# Altium project SD_Card.PrjPcb
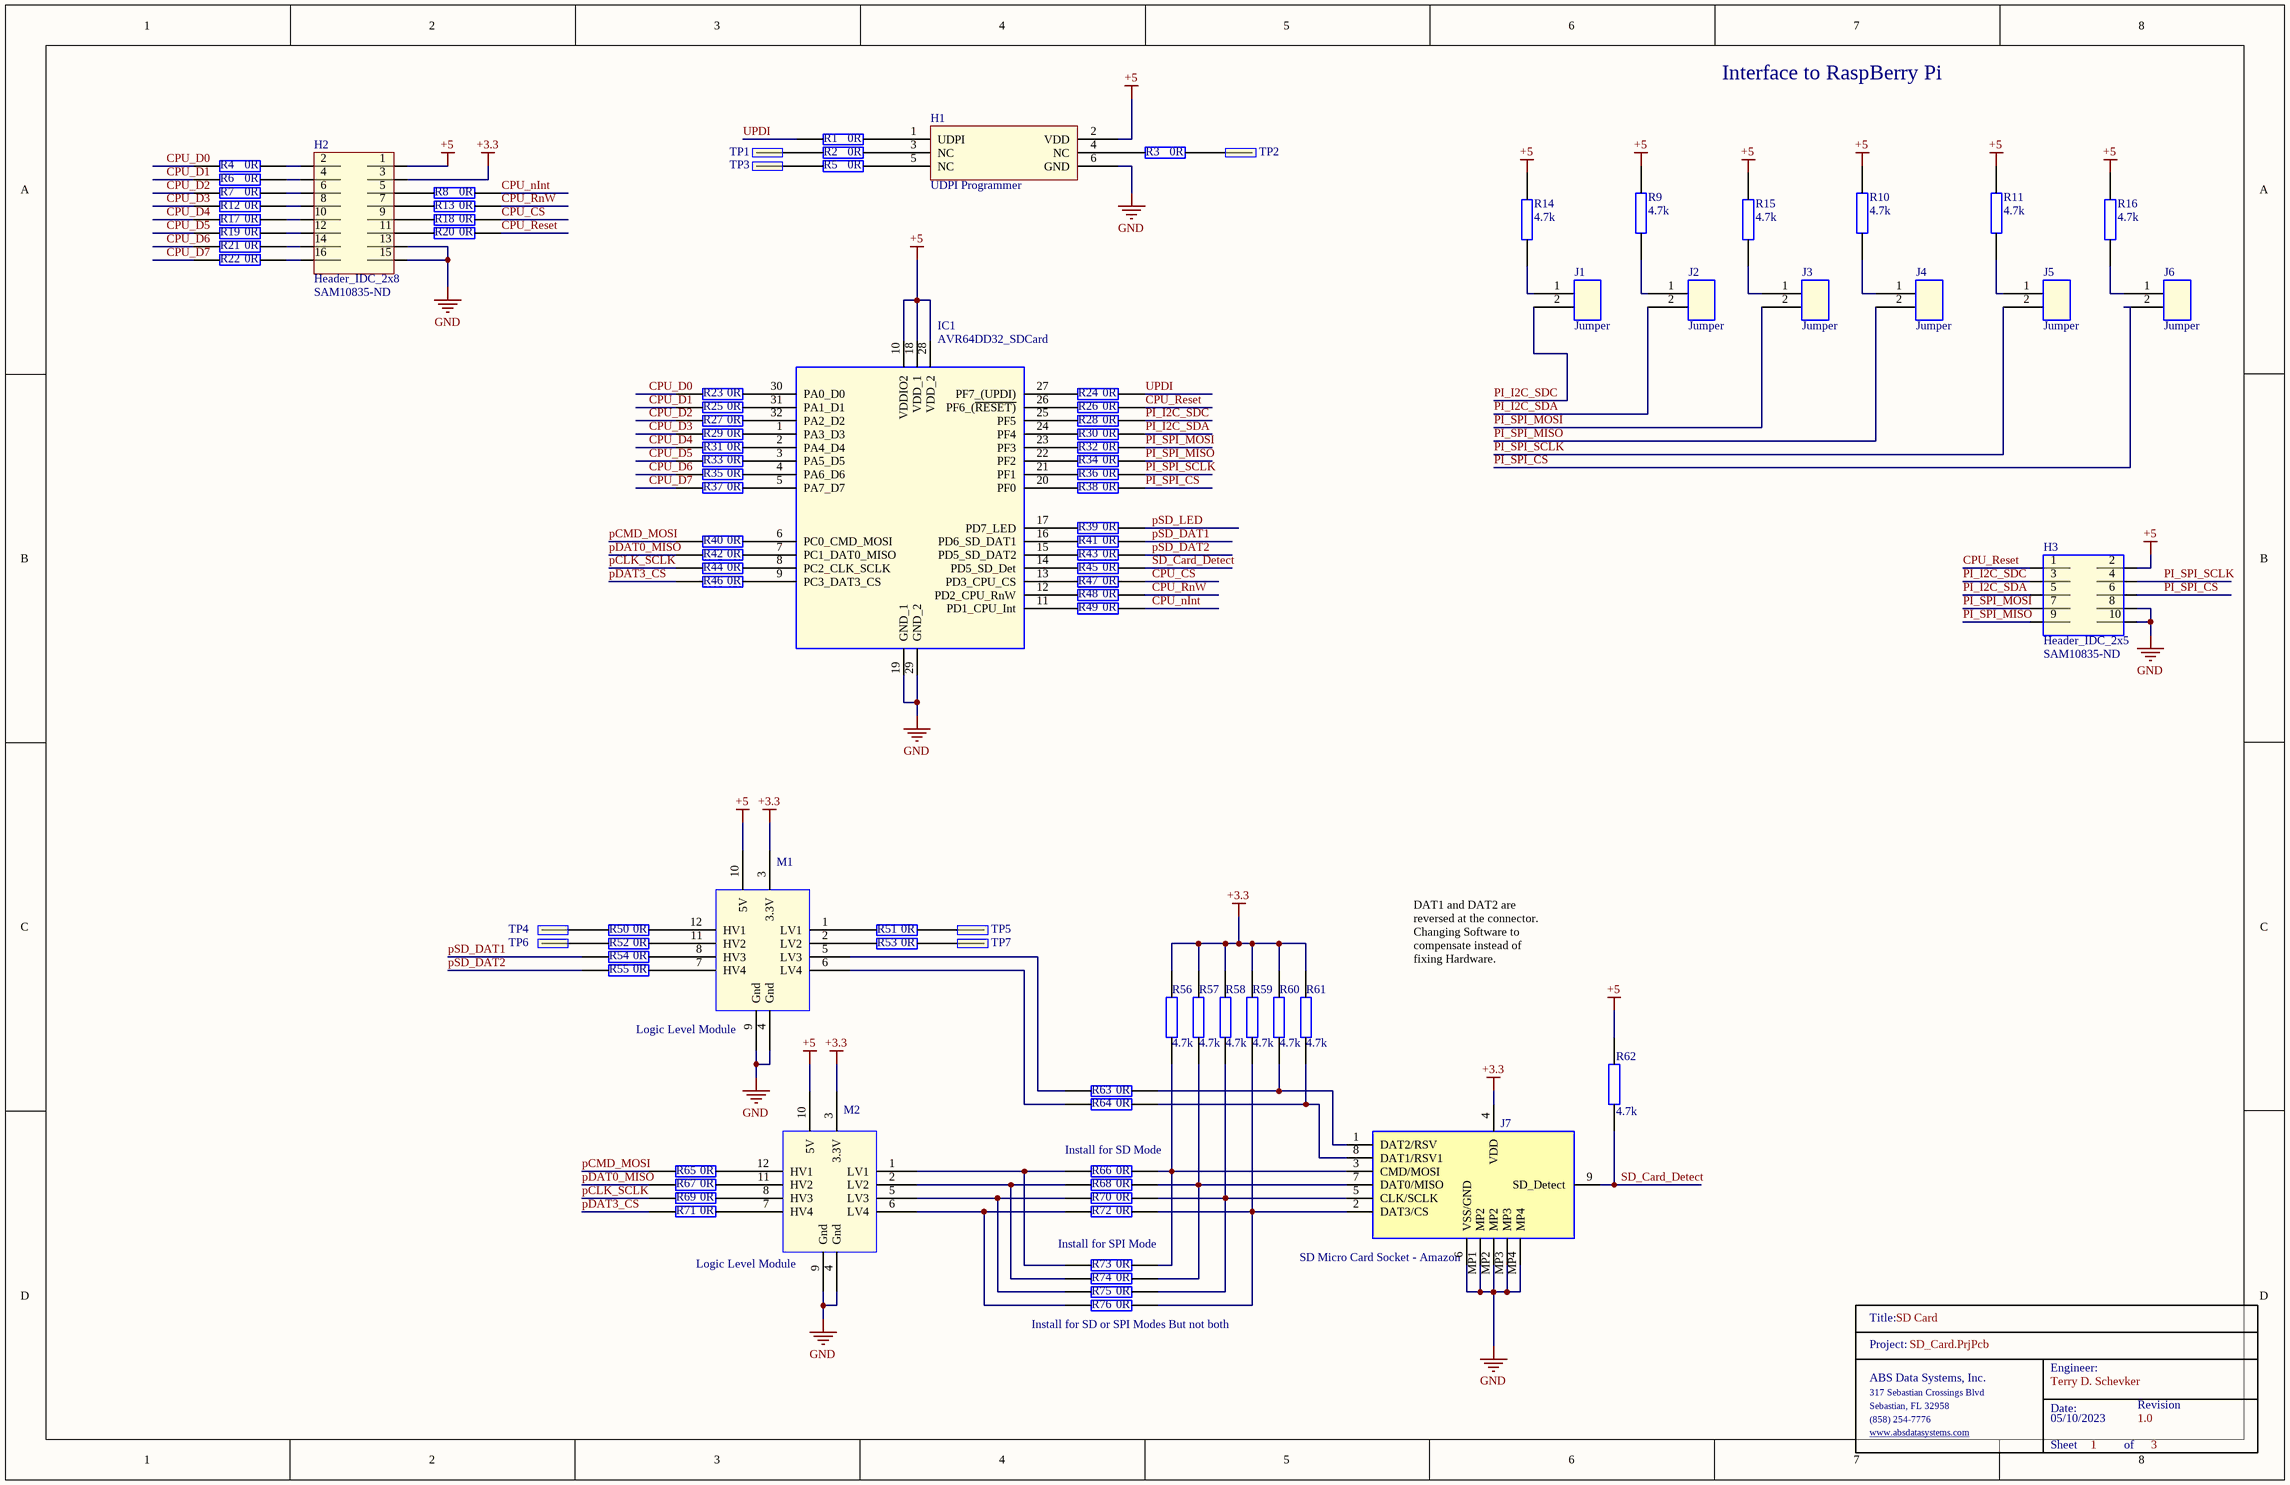
[diagram p0: SD_Card.SchDoc]
3 sheets, 201 parts. Net scope: global (net labels, ports and power ports of the same name join across sheets).
Board file: SD_Card_PCB.PcbDoc
Sheets:
  SD_Card.SchDoc
  PowerSupply.SchDoc
  SD_Card_Led_Monitor.SchDoc

## Sheet SD_Card.SchDoc: SD Card
size Tabloid; Date: 05/10/2023; Engineer: Terry D. Schevker; Revision: 1.0; SheetNumber: 1; SheetTotal: 3

### Parts
H1  UDPI Programmer  [HDR2X3]
H2  Header_IDC_2x8  Supplier Part Number 1: SAM10835-ND  [HEADER16]
H3  Header_IDC_2x5  Supplier Part Number 1: SAM10835-ND  [HDR2X5]
IC1  AVR64DD32_SDCard  [QFP80P900X900X120-32N]
J1  Jumper  [Jumper]
J2  Jumper  [Jumper]
J3  Jumper  [Jumper]
J4  Jumper  [Jumper]
J5  Jumper  [Jumper]
J6  Jumper  [Jumper]
J7  SD Micro Card Socket - Amazon  [SDMicroConnector]
M1  Logic Level Module  [Logic_Level_Module]
M2  Logic Level Module  [Logic_Level_Module]
R1  0R  [0603]
R2  0R  [0603]
R3  0R  [0603]
R4  0R  [0603]
R5  0R  [0603]
R6  0R  [0603]
R7  0R  [0603]
R8  0R  [0603]
R9  4.7k  [0603]
R10  4.7k  [0603]
R11  4.7k  [0603]
R12  0R  [0603]
R13  0R  [0603]
R14  4.7k  [0603]
R15  4.7k  [0603]
R16  4.7k  [0603]
R17  0R  [0603]
R18  0R  [0603]
R19  0R  [0603]
R20  0R  [0603]
R21  0R  [0603]
R22  0R  [0603]
R23  0R  [0603]
R24  0R  [0603]
R25  0R  [0603]
R26  0R  [0603]
R27  0R  [0603]
R28  0R  [0603]
R29  0R  [0603]
R30  0R  [0603]
R31  0R  [0603]
R32  0R  [0603]
R33  0R  [0603]
R34  0R  [0603]
R35  0R  [0603]
R36  0R  [0603]
R37  0R  [0603]
R38  0R  [0603]
R39  0R  [0603]
R40  0R  [0603]
R41  0R  [0603]
R42  0R  [0603]
R43  0R  [0603]
R44  0R  [0603]
R45  0R  [0603]
R46  0R  [0603]
R47  0R  [0603]
R48  0R  [0603]
R49  0R  [0603]
R50  0R  [0603]
R51  0R  [0603]
R52  0R  [0603]
R53  0R  [0603]
R54  0R  [0603]
R55  0R  [0603]
R56  4.7k  [0603]
R57  4.7k  [0603]
R58  4.7k  [0603]
R59  4.7k  [0603]
R60  4.7k  [0603]
R61  4.7k  [0603]
R62  4.7k  [0603]
R63  0R  [0603]
R64  0R  [0603]
R65  0R  [0603]
R66  0R  [0603]
R67  0R  [0603]
R68  0R  [0603]
R69  0R  [0603]
R70  0R  [0603]
R71  0R  [0603]
R72  0R  [0603]
R73  0R  [0603]
R74  0R  [0603]
R75  0R  [0603]
R76  0R  [0603]
TitleBlock_1  TitleBlock  (value not drawn)  (graphical)
TP1  TP  [TP]  (value not drawn)
TP2  TP  [TP]  (value not drawn)
TP3  TP  [TP]  (value not drawn)
TP4  TP  [TP]  (value not drawn)
TP5  TP  [TP]  (value not drawn)
TP6  TP  [TP]  (value not drawn)
TP7  TP  [TP]  (value not drawn)

### Nets
+3.3: H2.3 J7.4(VDD) M1.3(3.3V) M2.3(3.3V) R56.2 R57.2 R58.2 R59.2 R60.2 R61.2
+5: H1.2(VDD) H2.1 H3.2 IC1.10(VDDIO2) IC1.18(VDD_1) IC1.28(VDD_2) M1.10(5V) M2.10(5V) R9.2 R10.2 R11.2 R14.2 R15.2 R16.1 R62.2
GND: H1.6(GND) H2.13 H2.15 H3.8 H3.10 IC1.19(GND_1) IC1.29(GND_2) J7.6(VSS/GND) J7.MP1(MP2) J7.MP2 J7.MP3 J7.MP4 M1.4(Gnd) M1.9(Gnd) M2.4(Gnd) M2.9(Gnd)
CPU_CS: R18.2 R47.2
CPU_D0: R4.1 R23.1
CPU_D1: R6.1 R25.1
CPU_D2: R7.1 R27.1
CPU_D3: R12.1 R29.1
CPU_D4: R17.1 R31.1
CPU_D5: R19.1 R33.1
CPU_D6: R21.1 R35.1
CPU_D7: R22.1 R37.1
CPU_nInt: R8.2 R49.2
CPU_Reset: H3.1 R20.2 R26.2
CPU_RnW: R13.2 R48.2
pCLK_SCLK: R44.1 R69.1
pCMD_MOSI: R40.1 R65.1
pDAT0_MISO: R42.1 R67.1
pDAT3_CS: R46.1 R71.1
PI_I2C_SDA: H3.5 J2.2 R30.2
PI_I2C_SDC: H3.3 J1.2 R28.2
PI_SPI_CS: H3.6 J6.2 R38.2
PI_SPI_MISO: H3.9 J4.2 R34.2
PI_SPI_MOSI: H3.7 J3.2 R32.2
PI_SPI_SCLK: H3.4 J5.2 R36.2
pSD_DAT1: R41.2 R54.1
pSD_DAT2: R43.2 R55.1
pSD_LED: R39.2
SD_Card_Detect: J7.9(SD_Detect) R45.2 R62.1
UPDI: R1.1 R24.2
NetH1_1: H1.1(UDPI) R1.2
NetH1_3: H1.3(NC) R2.2
NetH1_4: H1.4(NC) R3.1
NetH1_5: H1.5(NC) R5.2
NetH2_2: H2.2 R4.2
NetH2_4: H2.4 R6.2
NetH2_5: H2.5 R8.1
NetH2_6: H2.6 R7.2
NetH2_7: H2.7 R13.1
NetH2_8: H2.8 R12.2
NetH2_9: H2.9 R18.1
NetH2_10: H2.10 R17.2
NetH2_11: H2.11 R20.1
NetH2_12: H2.12 R19.2
NetH2_14: H2.14 R21.2
NetH2_16: H2.16 R22.2
NetIC1_1: IC1.1(PA3_D3) R29.2
NetIC1_2: IC1.2(PA4_D4) R31.2
NetIC1_3: IC1.3(PA5_D5) R33.2
NetIC1_4: IC1.4(PA6_D6) R35.2
NetIC1_5: IC1.5(PA7_D7) R37.2
NetIC1_6: IC1.6(PC0_CMD_MOSI) R40.2
NetIC1_7: IC1.7(PC1_DAT0_MISO) R42.2
NetIC1_8: IC1.8(PC2_CLK_SCLK) R44.2
NetIC1_9: IC1.9(PC3_DAT3_CS) R46.2
NetIC1_11: IC1.11(PD1_CPU_Int) R49.1
NetIC1_12: IC1.12(PD2_CPU_RnW) R48.1
NetIC1_13: IC1.13(PD3_CPU_CS) R47.1
NetIC1_14: IC1.14(PD5_SD_Det) R45.1
NetIC1_15: IC1.15(PD5_SD_DAT2) R43.1
NetIC1_16: IC1.16(PD6_SD_DAT1) R41.1
NetIC1_17: IC1.17(PD7_LED) R39.1
NetIC1_20: IC1.20(PF0) R38.1
NetIC1_21: IC1.21(PF1) R36.1
NetIC1_22: IC1.22(PF2) R34.1
NetIC1_23: IC1.23(PF3) R32.1
NetIC1_24: IC1.24(PF4) R30.1
NetIC1_25: IC1.25(PF5) R28.1
NetIC1_26: IC1.26(PF6_(~{RESET)}) R26.1
NetIC1_27: IC1.27(PF7_(UPDI)) R24.1
NetIC1_30: IC1.30(PA0_D0) R23.2
NetIC1_31: IC1.31(PA1_D1) R25.2
NetIC1_32: IC1.32(PA2_D2) R27.2
NetJ1_1: J1.1 R14.1
NetJ2_1: J2.1 R9.1
NetJ3_1: J3.1 R15.1
NetJ4_1: J4.1 R10.1
NetJ5_1: J5.1 R11.1
NetJ6_1: J6.1 R16.2
NetJ7_1: J7.1(DAT2/RSV) R60.1 R63.2
NetJ7_2: J7.2(DAT3/CS) R59.1 R72.2 R76.2
NetJ7_3: J7.3(CMD/MOSI) R56.1 R66.2 R73.2
NetJ7_5: J7.5(CLK/SCLK) R58.1 R70.2 R75.2
NetJ7_7: J7.7(DAT0/MISO) R57.1 R68.2 R74.2
NetJ7_8: J7.8(DAT1/RSV1) R61.1 R64.2
NetM1_1: M1.1(LV1) R51.1
NetM1_2: M1.2(LV2) R53.1
NetM1_5: M1.5(LV3) R63.1
NetM1_6: M1.6(LV4) R64.1
NetM1_7: M1.7(HV4) R55.2
NetM1_8: M1.8(HV3) R54.2
NetM1_11: M1.11(HV2) R52.2
NetM1_12: M1.12(HV1) R50.2
NetM2_1: M2.1(LV1) R66.1 R73.1
NetM2_2: M2.2(LV2) R68.1 R74.1
NetM2_5: M2.5(LV3) R70.1 R75.1
NetM2_6: M2.6(LV4) R72.1 R76.1
NetM2_7: M2.7(HV4) R71.2
NetM2_8: M2.8(HV3) R69.2
NetM2_11: M2.11(HV2) R67.2
NetM2_12: M2.12(HV1) R65.2
NetR2_1: R2.1 TP1.1
NetR3_2: R3.2 TP2.1
NetR5_1: R5.1 TP3.1
NetR50_1: R50.1 TP4.1
NetR51_2: R51.2 TP5.1
NetR52_1: R52.1 TP6.1
NetR53_2: R53.2 TP7.1

### Notes on the sheet
- Interface to RaspBerry Pi
- sei();
- DAT1 and DAT2 are reversed at the connector. Changing Software to compensate instead of fixing Hardware.
- (near R66) Install for SD Mode
- (near R73) Install for SPI Mode
- (near R76) Install for SD or SPI Modes But not both
- (in symbol TitleBlock) Title:; Project:; Engineer:; ABS Data Systems, Inc.; 317 Sebastian Crossings Blvd; Sebastian, FL 32958; Date:; Revision; (858) 254-7776; www.absdatasystems.com; Sheet; of

### Library data of the parts
H1 = UDPI Programmer: 6 Pin 2X3 Through Hole Header
H2 = Header_IDC_2x8: 16 Pin 2x8 Through Hold IDC Connector; Manufacturer: Samtec; Manufacturer Part Number: TST-108-01-G-D; Number of Contacts: 16; Gender: Male; Connector Type: Male Pin; Pitch: 2.54mm; Row Spacing: 0.1inch; Supplier 1: Digi-Key; RoHS: Yes; Category: Headers and Wire Housings; Stock 1: 227; Pricing 1: 1=2.85000, 10=2.73600, 100=2.28000, 500=1.93800, 1000=1.65300, 5000=1.48200 (USD); Mount: Through Hole; Contact Plating: Gold; Contact Material: Bronze; Housing Material: Polyester; Housing Color: Black; Color: Black; Min Operating Temperature: -55°C; Max Operating Temperature: 125°C; Number of Rows: 2; Termination: Solder; Packaging: Rail/Tube; Orientation: Straight; Number of Positions: 16; Length: 27.94mm; Depth: 9.27mm; Contact Mating Length: 0.25inch; REACH SVHC: No SVHC; ComponentLink1URL: https://datasheet.ciiva.com/739/tst-mkt-739845.pdf?src-supplier=Digi-Key; ComponentLink1Description: https://datasheet.ciiva.com/739/tst-mkt-739845.pdf?src-supplier=Digi-Key; ComponentLink2URL: https://datasheet.ciiva.com/10018/htst-10018510.pdf?src-supplier=Avnet; ComponentLink2Description: https://datasheet.ciiva.com/10018/htst-10018510.pdf?src-supplier=Avnet
H3 = Header_IDC_2x5: 10 Pin 2x5 Through Hold IDC Connector; Manufacturer: Samtec; Manufacturer Part Number: TST-105-01-G-D; Number of Contacts: 16; Gender: Male; Connector Type: Male Pin; Pitch: 2.54mm; Row Spacing: 0.1inch; Supplier 1: Digi-Key; RoHS: Yes; Category: Headers and Wire Housings; Stock 1: 227; Pricing 1: 1=2.85000, 10=2.73600, 100=2.28000, 500=1.93800, 1000=1.65300, 5000=1.48200 (USD); Mount: Through Hole; Contact Plating: Gold; Contact Material: Bronze; Housing Material: Polyester; Housing Color: Black; Color: Black; Min Operating Temperature: -55°C; Max Operating Temperature: 125°C; Number of Rows: 2; Termination: Solder; Packaging: Rail/Tube; Orientation: Straight; Number of Positions: 16; Length: 27.94mm; Depth: 9.27mm; Contact Mating Length: 0.25inch; REACH SVHC: No SVHC; ComponentLink1URL: https://datasheet.ciiva.com/739/tst-mkt-739845.pdf?src-supplier=Digi-Key; ComponentLink1Description: https://datasheet.ciiva.com/739/tst-mkt-739845.pdf?src-supplier=Digi-Key; ComponentLink2URL: https://datasheet.ciiva.com/10018/htst-10018510.pdf?src-supplier=Avnet; ComponentLink2Description: https://datasheet.ciiva.com/10018/htst-10018510.pdf?src-supplier=Avnet
IC1 = AVR64DD32_SDCard: Integrated Circuit; Manufacturer_Name: Microchip; Manufacturer_Part_Number: AVR64DD32-I/PT | MULTI-VOLTAGE I/O; Datasheet Link: https://www.microchip.com/en-us/product/AVR64DD32; Height: 1.2mm
J1-J6 = Jumper: 16 Pin 3x8 Through Hold Jumprts; Manufacturer: Samtec; Manufacturer Part Number: TST-108-01-G-D; Number of Contacts: 16; Gender: Male; Connector Type: Male Pin; Pitch: 2.54mm; Row Spacing: 0.1inch; Supplier 1: Digi-Key; RoHS: Yes; Category: Headers and Wire Housings; Stock 1: 227; Pricing 1: 1=2.85000, 10=2.73600, 100=2.28000, 500=1.93800, 1000=1.65300, 5000=1.48200 (USD); Mount: Through Hole; Contact Plating: Gold; Contact Material: Bronze; Housing Material: Polyester; Housing Color: Black; Color: Black; Min Operating Temperature: -55°C; Max Operating Temperature: 125°C; Number of Rows: 2; Termination: Solder; Packaging: Rail/Tube; Orientation: Straight; Number of Positions: 16; Length: 27.94mm; Depth: 9.27mm; Contact Mating Length: 0.25inch; REACH SVHC: No SVHC; ComponentLink1URL: https://datasheet.ciiva.com/739/tst-mkt-739845.pdf?src-supplier=Digi-Key; ComponentLink1Description: https://datasheet.ciiva.com/739/tst-mkt-739845.pdf?src-supplier=Digi-Key; ComponentLink2URL: https://datasheet.ciiva.com/10018/htst-10018510.pdf?src-supplier=Avnet; ComponentLink2Description: https://datasheet.ciiva.com/10018/htst-10018510.pdf?src-supplier=Avnet
J7 = SD_Micro_Socket: Memory Card Connectors 9P R/A SMT MICRO SD HINGE PUSH-PULL; Manufacturer_Name: Hirose; Manufacturer_Part_Number: DM3CS-SF; Geometry.Height: 1.83mm; Mouser Part Number: 798-DM3CSSF; Mouser Price/Stock: https://www.mouser.co.uk/ProductDetail/Hirose-Connector/DM3CS-SF?qs=tTj%252BmQ3KZwbB9K5zh89Rcw%3D%3D; Datasheet Link: https://datasheet.lcsc.com/szlcsc/Hirose-HRS-DM3CS-SF_C202111.pdf
M1 M2 = Logic_Level_Module: Logic Level Converter Module
R1-R8 R12 R13 R17-R55 R63-R76 = RC0603JR-070RL: YAGEO 0603 0 ohm; Manufacturer_Name: KEMET; Geometry.Height: 0.55mm; Mouser Part Number: 603-RC0603JR-070RL; Mouser Price/Stock: https://www.mouser.co.uk/ProductDetail/YAGEO/RC0603JR-070RL?qs=2cAdsCoAWRGWyPcuXgGiXQ%3D%3D; Manufacturer_Part_Number: RC0603JR-070RL; Datasheet Link: https://datasheet.datasheetarchive.com/originals/distributors/Datasheets_SAMA/902f9e387b938f871d31120f5fc1d65e.pdf
R9-R11 R14-R16 R56-R62 = RC0603FR-104K7L: YAGEO 0603 4.7k; Manufacturer_Name: KEMET; Manufacturer_Part_Number: RC0603JR-070RL; Geometry.Height: 0.55mm; Mouser Part Number: 603-RC0603JR-070RL; Mouser Price/Stock: https://www.mouser.co.uk/ProductDetail/YAGEO/RC0603JR-070RL?qs=2cAdsCoAWRGWyPcuXgGiXQ%3D%3D; Datasheet Link: https://datasheet.datasheetarchive.com/originals/distributors/Datasheets_SAMA/902f9e387b938f871d31120f5fc1d65e.pdf
TP1-TP7 = TP: Manufacturer: Samtec; Manufacturer Part Number: TST-105-01-G-D; Number of Contacts: 16; Gender: Male; Connector Type: Male Pin; Pitch: 2.54mm; Row Spacing: 0.1inch; Supplier 1: Digi-Key; RoHS: Yes; Category: Headers and Wire Housings; Stock 1: 227; Pricing 1: 1=2.85000, 10=2.73600, 100=2.28000, 500=1.93800, 1000=1.65300, 5000=1.48200 (USD); Mount: Through Hole; Contact Plating: Gold; Contact Material: Bronze; Housing Material: Polyester; Housing Color: Black; Color: Black; Min Operating Temperature: -55°C; Max Operating Temperature: 125°C; Number of Rows: 2; Termination: Solder; Packaging: Rail/Tube; Orientation: Straight; Number of Positions: 16; Length: 27.94mm; Depth: 9.27mm; Contact Mating Length: 0.25inch; REACH SVHC: No SVHC; ComponentLink1URL: https://datasheet.ciiva.com/739/tst-mkt-739845.pdf?src-supplier=Digi-Key; ComponentLink1Description: https://datasheet.ciiva.com/739/tst-mkt-739845.pdf?src-supplier=Digi-Key; ComponentLink2URL: https://datasheet.ciiva.com/10018/htst-10018510.pdf?src-supplier=Avnet; ComponentLink2Description: https://datasheet.ciiva.com/10018/htst-10018510.pdf?src-supplier=Avnet

## Sheet PowerSupply.SchDoc: SD Card Power Board
size Tabloid; Date: 05/10/2023; Engineer: Terry D. Schevker; Revision: 1.0; SheetNumber: 2; SheetTotal: 3
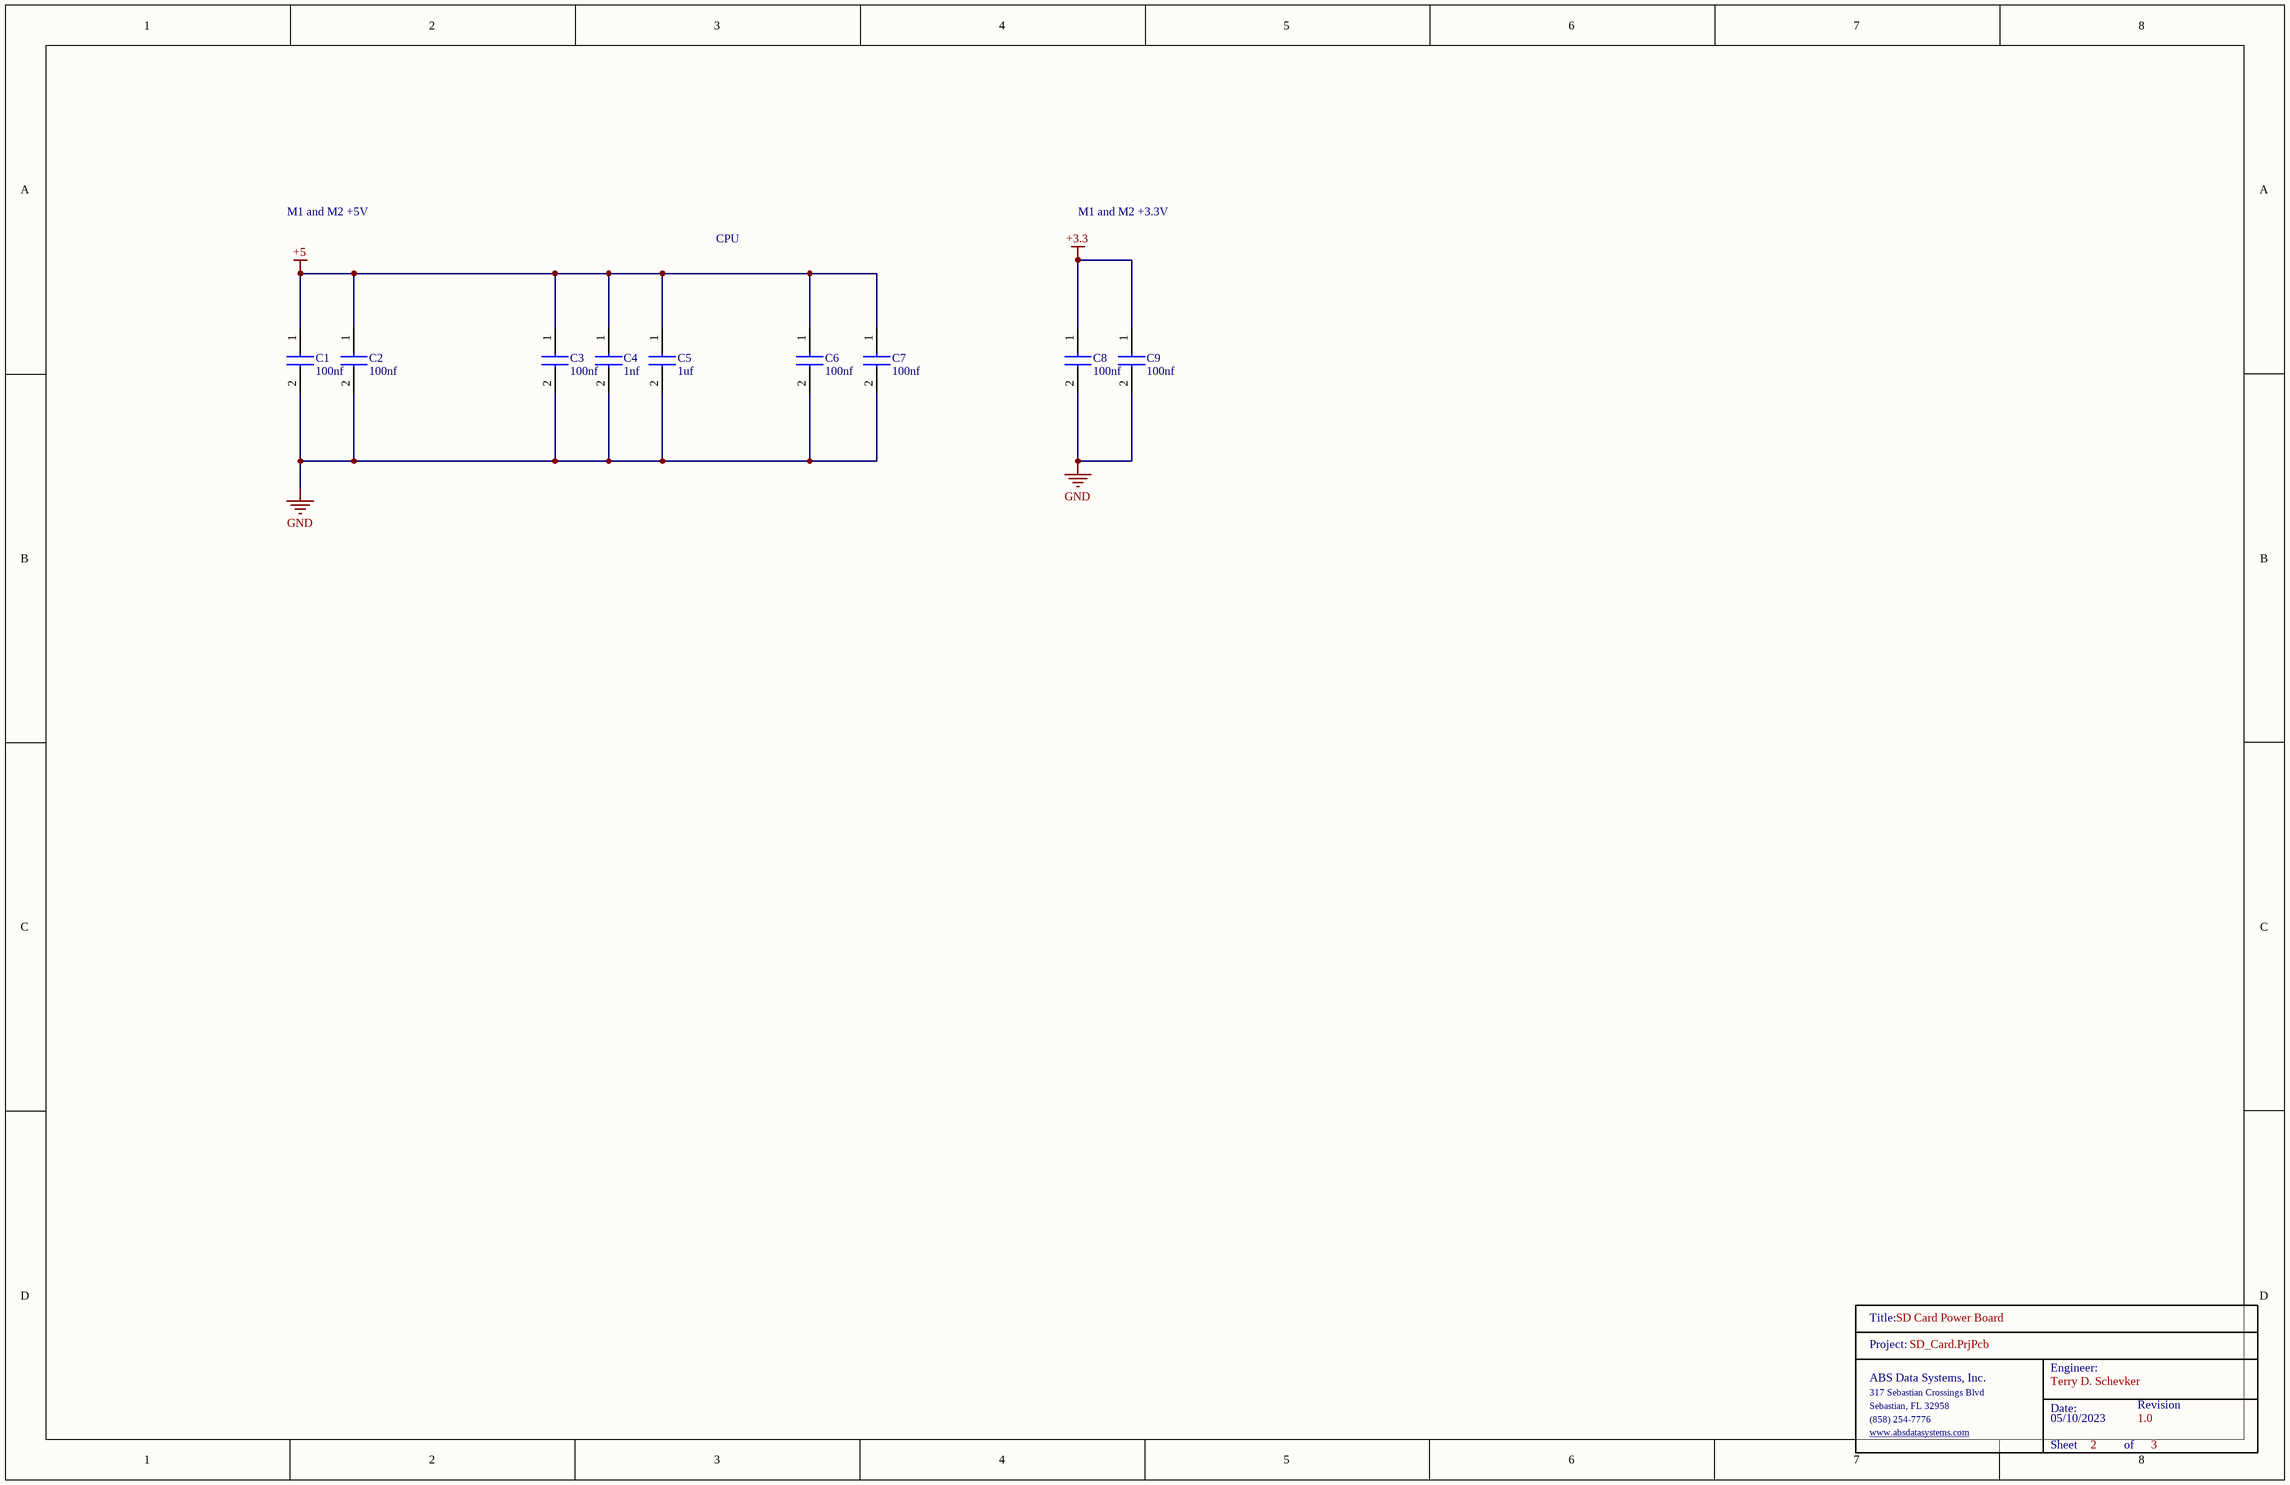
[diagram p1: PowerSupply.SchDoc]

### Parts
C1  100nf  [0603]
C2  100nf  [0603]
C3  100nf  [0603]
C4  1nf  [0603]
C5  1uf  [0603]
C6  100nf  [0603]
C7  100nf  [0603]
C8  100nf  [0603]
C9  100nf  [0603]
TitleBlock_2  TitleBlock  (value not drawn)  (graphical)

### Nets
+3.3: C8.1 C9.1
+5: C1.1 C2.1 C3.1 C4.1 C5.1 C6.1 C7.1
GND: C1.2 C2.2 C3.2 C4.2 C5.2 C6.2 C7.2 C8.2 C9.2

### Notes on the sheet
- M1 and M2 +5V
- M1 and M2 +3.3V
- CPU
- (in symbol TitleBlock) Title:; Project:; Engineer:; ABS Data Systems, Inc.; 317 Sebastian Crossings Blvd; Sebastian, FL 32958; Date:; Revision; (858) 254-7776; www.absdatasystems.com; Sheet; of

### Library data of the parts
C1-C3 C6-C9 = CL10B104JB8NNNC: Samsung Electro-Mechanics 0603 100nf
C4 = CL10B102KB8NNNL: Samsung Electro-Mechanics 0603 1nf
C5 = CL10B105KA8NNNL: Samsung Electro-Mechanics 0603 1uf

## Sheet SD_Card_Led_Monitor.SchDoc: SD Card LED Monitor
size Tabloid; Date: 05/10/2023; Engineer: Terry D. Schevker; Revision: 1.0; SheetNumber: 3; SheetTotal: 3
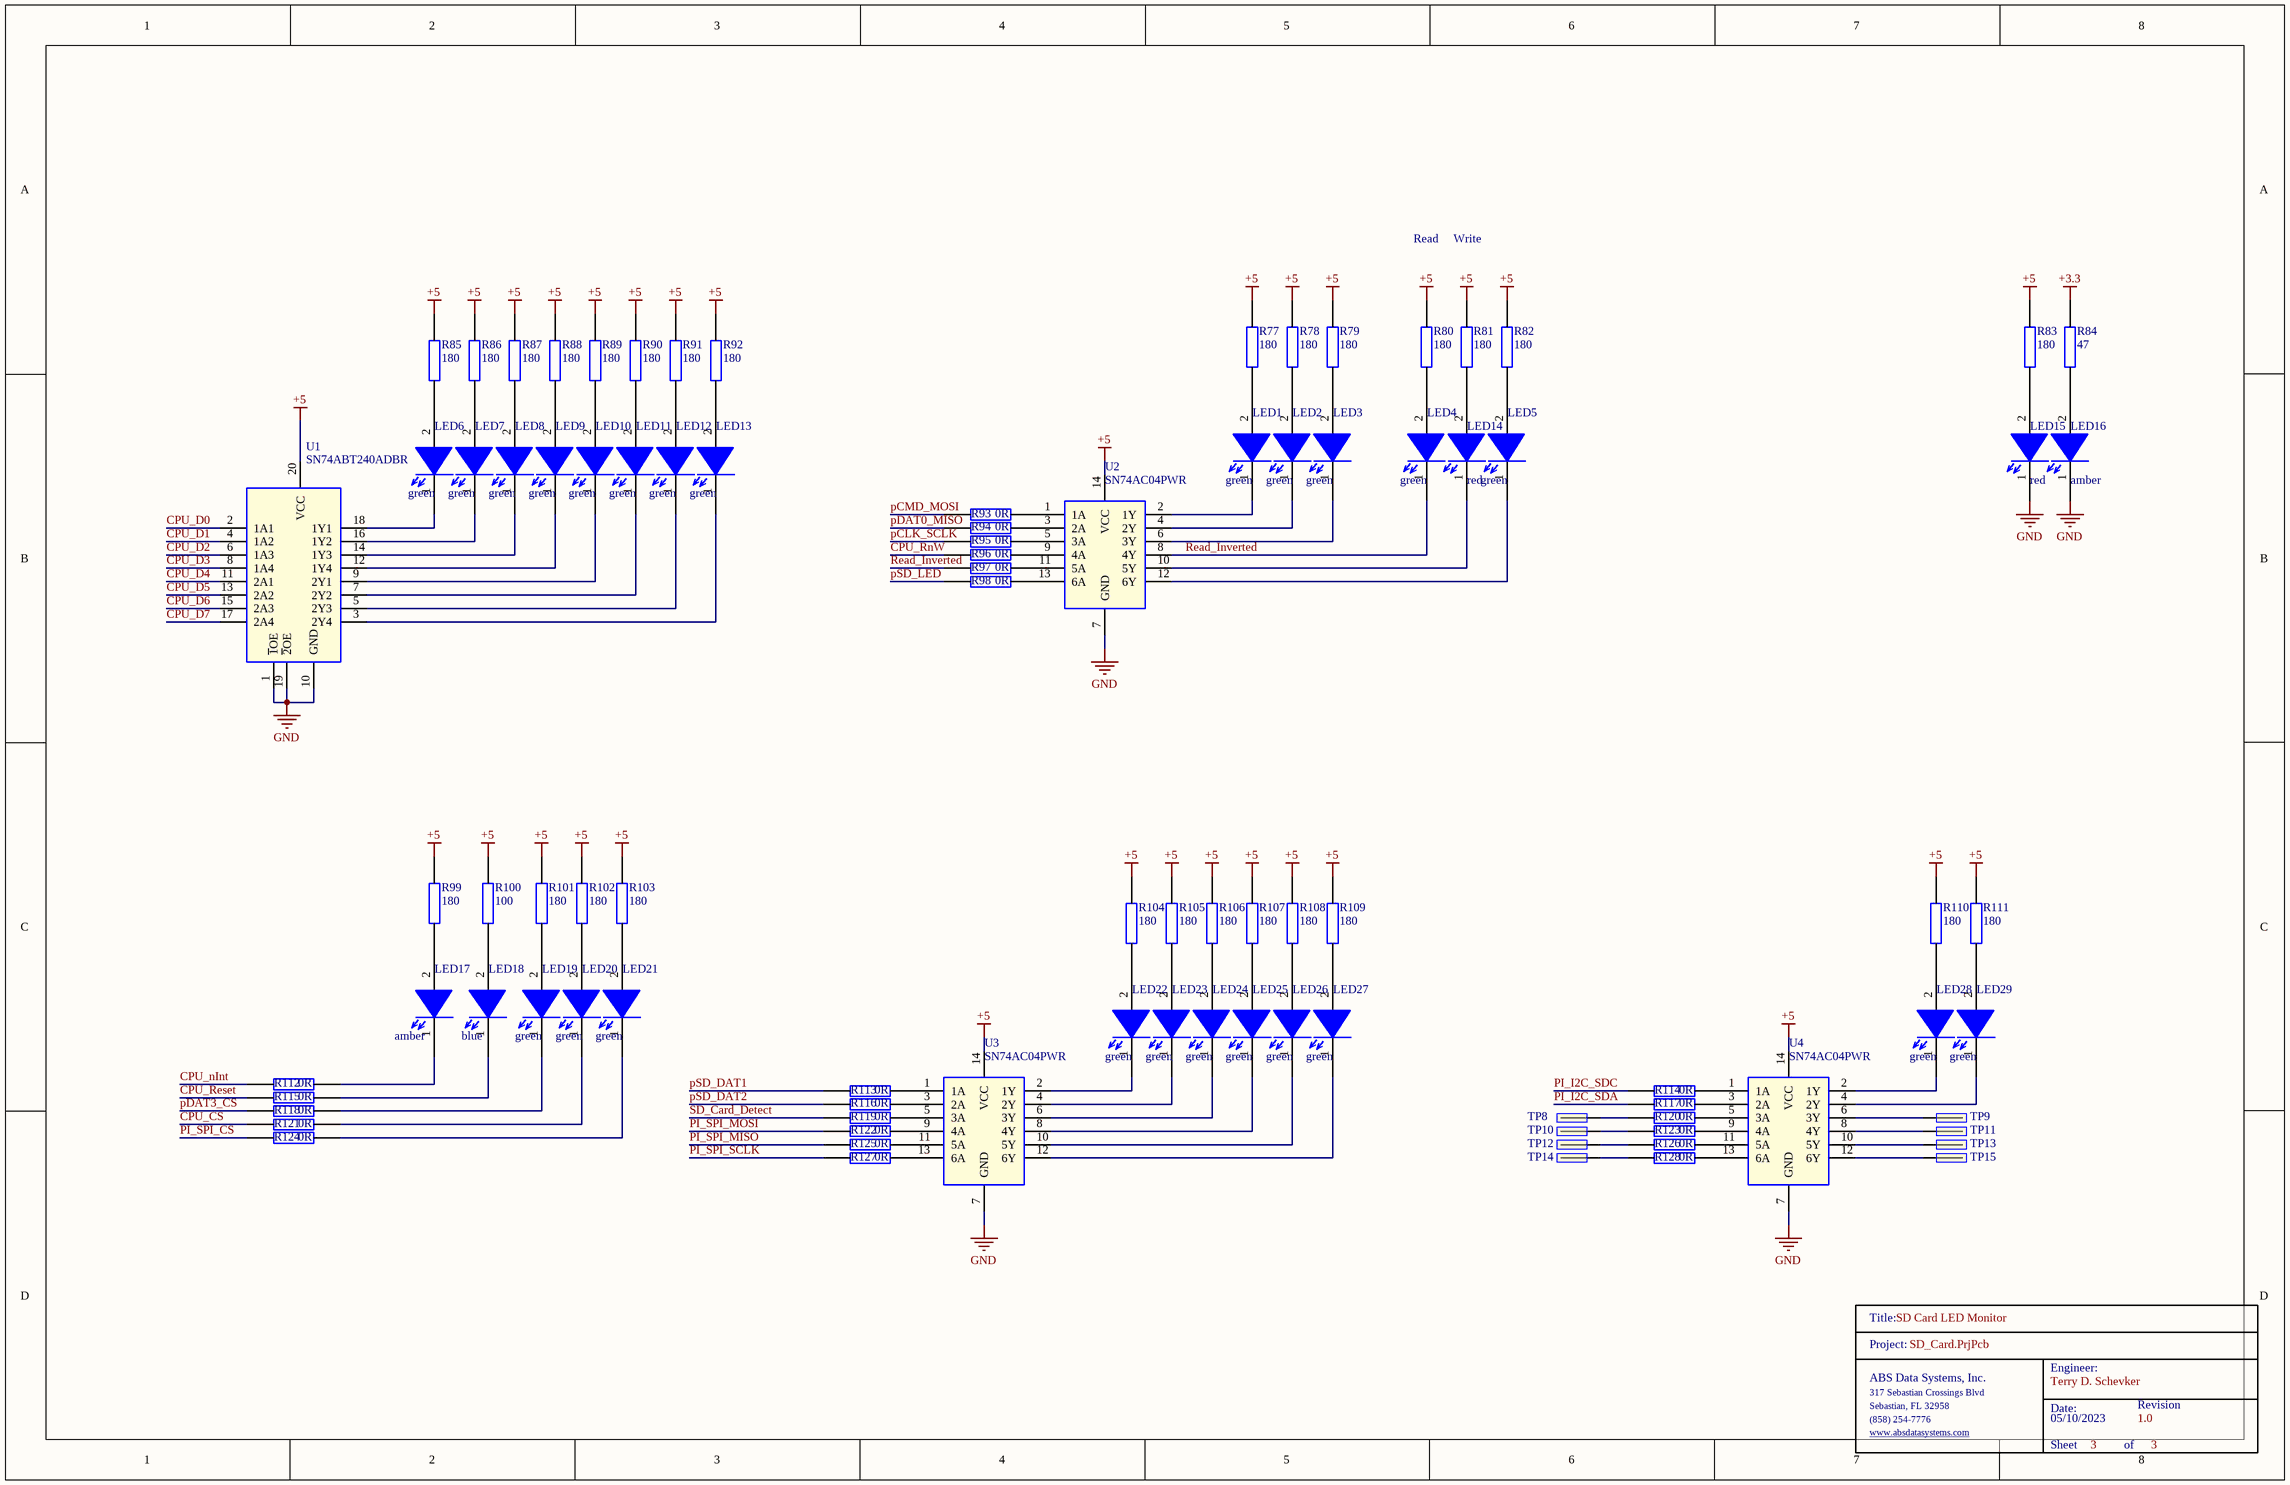
[diagram p2: SD_Card_Led_Monitor.SchDoc]

### Parts
LED1  green  [0603_Diode]
LED2  green  [0603_Diode]
LED3  green  [0603_Diode]
LED4  green  [0603_Diode]
LED5  green  [0603_Diode]
LED6  green  [0603_Diode]
LED7  green  [0603_Diode]
LED8  green  [0603_Diode]
LED9  green  [0603_Diode]
LED10  green  [0603_Diode]
LED11  green  [0603_Diode]
LED12  green  [0603_Diode]
LED13  green  [0603_Diode]
LED14  red  [0603_Diode]
LED15  red  [0603_Diode]
LED16  amber  [0603_Diode]
LED17  amber  [0603_Diode]
LED18  blue  [0603_Diode]
LED19  green  [0603_Diode]
LED20  green  [0603_Diode]
LED21  green  [0603_Diode]
LED22  green  [0603_Diode]
LED23  green  [0603_Diode]
LED24  green  [0603_Diode]
LED25  green  [0603_Diode]
LED26  green  [0603_Diode]
LED27  green  [0603_Diode]
LED28  green  [0603_Diode]
LED29  green  [0603_Diode]
R77  180  [0603]
R78  180  [0603]
R79  180  [0603]
R80  180  [0603]
R81  180  [0603]
R82  180  [0603]
R83  180  [0603]
R84  47  [0603]
R85  180  [0603]
R86  180  [0603]
R87  180  [0603]
R88  180  [0603]
R89  180  [0603]
R90  180  [0603]
R91  180  [0603]
R92  180  [0603]
R93  0R  [0603]
R94  0R  [0603]
R95  0R  [0603]
R96  0R  [0603]
R97  0R  [0603]
R98  0R  [0603]
R99  180  [0603]
R100  100  [0603]
R101  180  [0603]
R102  180  [0603]
R103  180  [0603]
R104  180  [0603]
R105  180  [0603]
R106  180  [0603]
R107  180  [0603]
R108  180  [0603]
R109  180  [0603]
R110  180  [0603]
R111  180  [0603]
R112  0R  [0603]
R113  0R  [0603]
R114  0R  [0603]
R115  0R  [0603]
R116  0R  [0603]
R117  0R  [0603]
R118  0R  [0603]
R119  0R  [0603]
R120  0R  [0603]
R121  0R  [0603]
R122  0R  [0603]
R123  0R  [0603]
R124  0R  [0603]
R125  0R  [0603]
R126  0R  [0603]
R127  0R  [0603]
R128  0R  [0603]
TitleBlock_3  TitleBlock  (value not drawn)  (graphical)
TP8  TP  [TP]  (value not drawn)
TP9  TP  [TP]  (value not drawn)
TP10  TP  [TP]  (value not drawn)
TP11  TP  [TP]  (value not drawn)
TP12  TP  [TP]  (value not drawn)
TP13  TP  [TP]  (value not drawn)
TP14  TP  [TP]  (value not drawn)
TP15  TP  [TP]  (value not drawn)
U1  SN74ABT240ADBR  [SOP65P780X200-20N]
U2  SN74AC04PWR  [SOP65P640X120-14N]
U3  SN74AC04PWR  [SOP65P640X120-14N]
U4  SN74AC04PWR  [SOP65P640X120-14N]

### Nets
+3.3: R84.1
+5: R77.2 R78.2 R79.2 R80.2 R81.2 R82.2 R83.2 R85.2 R86.2 R87.2 R88.2 R89.2 R90.2 R91.2 R92.2 R99.2 R100.1 R101.2 R102.2 R103.2 R104.2 R105.2 R106.2 R107.2 R108.2 R109.2 R110.2 R111.2 U1.20(VCC) U2.14(VCC) U3.14(VCC) U4.14(VCC)
GND: LED15.1(K) LED16.1(K) U1.1(~{1}OE) U1.10(GND) U1.19(~{2}OE) U2.7(GND) U3.7(GND) U4.7(GND)
CPU_CS: R121.1
CPU_D0: U1.2(1A1)
CPU_D1: U1.4(1A2)
CPU_D2: U1.6(1A3)
CPU_D3: U1.8(1A4)
CPU_D4: U1.11(2A1)
CPU_D5: U1.13(2A2)
CPU_D6: U1.15(2A3)
CPU_D7: U1.17(2A4)
CPU_nInt: R112.1
CPU_Reset: R115.1
CPU_RnW: R96.1
pCLK_SCLK: R95.1
pCMD_MOSI: R93.1
pDAT0_MISO: R94.1
pDAT3_CS: R118.1
PI_I2C_SDA: R117.1
PI_I2C_SDC: R114.1
PI_SPI_CS: R124.1
PI_SPI_MISO: R125.1
PI_SPI_MOSI: R122.1
PI_SPI_SCLK: R127.1
pSD_DAT1: R113.1
pSD_DAT2: R116.1
pSD_LED: R98.1
Read_Inverted: LED4.1(K) R97.1 U2.8(4Y)
SD_Card_Detect: R119.1
NetLED1_1: LED1.1(K) U2.2(1Y)
NetLED1_2: LED1.2(A) R77.1
NetLED2_1: LED2.1(K) U2.4(2Y)
NetLED2_2: LED2.2(A) R78.1
NetLED3_1: LED3.1(K) U2.6(3Y)
NetLED3_2: LED3.2(A) R79.1
NetLED4_2: LED4.2(A) R80.1
NetLED5_1: LED5.1(K) U2.12(6Y)
NetLED5_2: LED5.2(A) R82.1
NetLED6_1: LED6.1(K) U1.18(1Y1)
NetLED6_2: LED6.2(A) R85.1
NetLED7_1: LED7.1(K) U1.16(1Y2)
NetLED7_2: LED7.2(A) R86.1
NetLED8_1: LED8.1(K) U1.14(1Y3)
NetLED8_2: LED8.2(A) R87.1
NetLED9_1: LED9.1(K) U1.12(1Y4)
NetLED9_2: LED9.2(A) R88.1
NetLED10_1: LED10.1(K) U1.9(2Y1)
NetLED10_2: LED10.2(A) R89.1
NetLED11_1: LED11.1(K) U1.7(2Y2)
NetLED11_2: LED11.2(A) R90.1
NetLED12_1: LED12.1(K) U1.5(2Y3)
NetLED12_2: LED12.2(A) R91.1
NetLED13_1: LED13.1(K) U1.3(2Y4)
NetLED13_2: LED13.2(A) R92.1
NetLED14_1: LED14.1(K) U2.10(5Y)
NetLED14_2: LED14.2(A) R81.1
NetLED15_2: LED15.2(A) R83.1
NetLED16_2: LED16.2(A) R84.2
NetLED17_1: LED17.1(K) R112.2
NetLED17_2: LED17.2(A) R99.1
NetLED18_1: LED18.1(K) R115.2
NetLED18_2: LED18.2(A) R100.2
NetLED19_1: LED19.1(K) R118.2
NetLED19_2: LED19.2(A) R101.1
NetLED20_1: LED20.1(K) R121.2
NetLED20_2: LED20.2(A) R102.1
NetLED21_1: LED21.1(K) R124.2
NetLED21_2: LED21.2(A) R103.1
NetLED22_1: LED22.1(K) U3.2(1Y)
NetLED22_2: LED22.2(A) R104.1
NetLED23_1: LED23.1(K) U3.4(2Y)
NetLED23_2: LED23.2(A) R105.1
NetLED24_1: LED24.1(K) U3.6(3Y)
NetLED24_2: LED24.2(A) R106.1
NetLED25_1: LED25.1(K) U3.8(4Y)
NetLED25_2: LED25.2(A) R107.1
NetLED26_1: LED26.1(K) U3.10(5Y)
NetLED26_2: LED26.2(A) R108.1
NetLED27_1: LED27.1(K) U3.12(6Y)
NetLED27_2: LED27.2(A) R109.1
NetLED28_1: LED28.1(K) U4.2(1Y)
NetLED28_2: LED28.2(A) R110.1
NetLED29_1: LED29.1(K) U4.4(2Y)
NetLED29_2: LED29.2(A) R111.1
NetR93_2: R93.2 U2.1(1A)
NetR94_2: R94.2 U2.3(2A)
NetR95_2: R95.2 U2.5(3A)
NetR96_2: R96.2 U2.9(4A)
NetR97_2: R97.2 U2.11(5A)
NetR98_2: R98.2 U2.13(6A)
NetR113_2: R113.2 U3.1(1A)
NetR114_2: R114.2 U4.1(1A)
NetR116_2: R116.2 U3.3(2A)
NetR117_2: R117.2 U4.3(2A)
NetR119_2: R119.2 U3.5(3A)
NetR120_1: R120.1 TP8.1
NetR120_2: R120.2 U4.5(3A)
NetR122_2: R122.2 U3.9(4A)
NetR123_1: R123.1 TP10.1
NetR123_2: R123.2 U4.9(4A)
NetR125_2: R125.2 U3.11(5A)
NetR126_1: R126.1 TP12.1
NetR126_2: R126.2 U4.11(5A)
NetR127_2: R127.2 U3.13(6A)
NetR128_1: R128.1 TP14.1
NetR128_2: R128.2 U4.13(6A)
NetTP9_1: TP9.1 U4.6(3Y)
NetTP11_1: TP11.1 U4.8(4Y)
NetTP13_1: TP13.1 U4.10(5Y)
NetTP15_1: TP15.1 U4.12(6Y)

### Notes on the sheet
- Read
- Write
- (in symbol TitleBlock) Title:; Project:; Engineer:; ABS Data Systems, Inc.; 317 Sebastian Crossings Blvd; Sebastian, FL 32958; Date:; Revision; (858) 254-7776; www.absdatasystems.com; Sheet; of

### Library data of the parts
LED1-LED13 LED19-LED29 = 150060GS75000: Wurth Elektronik 0603 green; Manufacturer: Wurth Electronics; Wavelength: 520nm; Viewing Angle: 140°; Lens Style: Clear,Rectangular; Luminous Intensity: 430mcd; Forward Current: 30mA; Forward Voltage: 3.2V; Test Current: 20mA; Supplier 1: Digi-Key; Manufacturer Part Number: 150060GS75000; RoHS: Yes; Category: LEDs; Stock 1: 71509; Pricing 1: 1=0.14000, 50=0.13300, 100=0.11400, 500=0.09900 (USD); Mount: Surface Mount; Case/Package: 0603; Color: Green; Case Code (Metric): 1608; Case Code (Imperial): 0603; Min Operating Temperature: -40°C; Max Operating Temperature: 85°C; Package Quantity: 4000; Packaging: Tape and Reel; Dominant Wavelength: 520nm; Length: 1.6mm; Width: 0.8mm; Height: 0.7mm; REACH SVHC: Unknown; Lead Free: Lead Free; ComponentLink1URL: https://datasheet.ciiva.com/29562/150060gs75000-29562868.pdf?src-supplier=Digi-Key; ComponentLink1Description: https://datasheet.ciiva.com/29562/150060gs75000-29562868.pdf?src-supplier=Digi-Key; ComponentLink2URL: https://datasheet.ciiva.com/29279/759427-da-01-en-chipled-0603-w-kl-gruen-150060gs75000-29279201.pdf?src-supplier=Conrad; ComponentLink2Description: https://datasheet.ciiva.com/29279/759427-da-01-en-chipled-0603-w-kl-gruen-150060gs75000-29279201.pdf?src-supplier=Conrad; ComponentLink3URL: https://datasheet.ciiva.com/29562/150060gs75000-29562869.pdf?src-supplier=Digi-Key; ComponentLink3Description: https://datasheet.ciiva.com/29562/150060gs75000-29562869.pdf?src-supplier=Digi-Key; ComponentLink4URL: https://datasheet.ciiva.com/29562/150060gs75000-29562870.pdf?src-supplier=Digi-Key; ComponentLink4Description: https://datasheet.ciiva.com/29562/150060gs75000-29562870.pdf?src-supplier=Digi-Key
LED14 LED15 = 150060RS75000: Wurth Elektronik 0603 red; Manufacturer: Wurth Electronics; Manufacturer Part Number: 150060GS75000; Color: Green; Wavelength: 520nm; Viewing Angle: 140°; Lens Style: Clear,Rectangular; Luminous Intensity: 430mcd; Forward Current: 30mA; Forward Voltage: 3.2V; Test Current: 20mA; Supplier 1: Digi-Key; RoHS: Yes; Category: LEDs; Stock 1: 71509; Pricing 1: 1=0.14000, 50=0.13300, 100=0.11400, 500=0.09900 (USD); Mount: Surface Mount; Case/Package: 0603; Case Code (Metric): 1608; Case Code (Imperial): 0603; Min Operating Temperature: -40°C; Max Operating Temperature: 85°C; Package Quantity: 4000; Packaging: Tape and Reel; Dominant Wavelength: 520nm; Length: 1.6mm; Width: 0.8mm; Height: 0.7mm; REACH SVHC: Unknown; Lead Free: Lead Free; ComponentLink1URL: https://datasheet.ciiva.com/29562/150060gs75000-29562868.pdf?src-supplier=Digi-Key; ComponentLink1Description: https://datasheet.ciiva.com/29562/150060gs75000-29562868.pdf?src-supplier=Digi-Key; ComponentLink2URL: https://datasheet.ciiva.com/29279/759427-da-01-en-chipled-0603-w-kl-gruen-150060gs75000-29279201.pdf?src-supplier=Conrad; ComponentLink2Description: https://datasheet.ciiva.com/29279/759427-da-01-en-chipled-0603-w-kl-gruen-150060gs75000-29279201.pdf?src-supplier=Conrad; ComponentLink3URL: https://datasheet.ciiva.com/29562/150060gs75000-29562869.pdf?src-supplier=Digi-Key; ComponentLink3Description: https://datasheet.ciiva.com/29562/150060gs75000-29562869.pdf?src-supplier=Digi-Key; ComponentLink4URL: https://datasheet.ciiva.com/29562/150060gs75000-29562870.pdf?src-supplier=Digi-Key; ComponentLink4Description: https://datasheet.ciiva.com/29562/150060gs75000-29562870.pdf?src-supplier=Digi-Key
LED16 LED17 = 150060AS75000: Wurth Elektronik 0603 amber; Manufacturer: Wurth Electronics; Manufacturer Part Number: 150060GS75000; Color: Green; Wavelength: 520nm; Viewing Angle: 140°; Lens Style: Clear,Rectangular; Luminous Intensity: 430mcd; Forward Current: 30mA; Forward Voltage: 3.2V; Test Current: 20mA; Supplier 1: Digi-Key; RoHS: Yes; Category: LEDs; Stock 1: 71509; Pricing 1: 1=0.14000, 50=0.13300, 100=0.11400, 500=0.09900 (USD); Mount: Surface Mount; Case/Package: 0603; Case Code (Metric): 1608; Case Code (Imperial): 0603; Min Operating Temperature: -40°C; Max Operating Temperature: 85°C; Package Quantity: 4000; Packaging: Tape and Reel; Dominant Wavelength: 520nm; Length: 1.6mm; Width: 0.8mm; Height: 0.7mm; REACH SVHC: Unknown; Lead Free: Lead Free; ComponentLink1URL: https://datasheet.ciiva.com/29562/150060gs75000-29562868.pdf?src-supplier=Digi-Key; ComponentLink1Description: https://datasheet.ciiva.com/29562/150060gs75000-29562868.pdf?src-supplier=Digi-Key; ComponentLink2URL: https://datasheet.ciiva.com/29279/759427-da-01-en-chipled-0603-w-kl-gruen-150060gs75000-29279201.pdf?src-supplier=Conrad; ComponentLink2Description: https://datasheet.ciiva.com/29279/759427-da-01-en-chipled-0603-w-kl-gruen-150060gs75000-29279201.pdf?src-supplier=Conrad; ComponentLink3URL: https://datasheet.ciiva.com/29562/150060gs75000-29562869.pdf?src-supplier=Digi-Key; ComponentLink3Description: https://datasheet.ciiva.com/29562/150060gs75000-29562869.pdf?src-supplier=Digi-Key; ComponentLink4URL: https://datasheet.ciiva.com/29562/150060gs75000-29562870.pdf?src-supplier=Digi-Key; ComponentLink4Description: https://datasheet.ciiva.com/29562/150060gs75000-29562870.pdf?src-supplier=Digi-Key
LED18 = 150060BS75000: Wurth Elektronik 0603 blue; Manufacturer: Wurth Electronics; Manufacturer Part Number: 150060GS75000; Color: Green; Wavelength: 520nm; Viewing Angle: 140°; Lens Style: Clear,Rectangular; Luminous Intensity: 430mcd; Forward Current: 30mA; Forward Voltage: 3.2V; Test Current: 20mA; Supplier 1: Digi-Key; RoHS: Yes; Category: LEDs; Stock 1: 71509; Pricing 1: 1=0.14000, 50=0.13300, 100=0.11400, 500=0.09900 (USD); Mount: Surface Mount; Case/Package: 0603; Case Code (Metric): 1608; Case Code (Imperial): 0603; Min Operating Temperature: -40°C; Max Operating Temperature: 85°C; Package Quantity: 4000; Packaging: Tape and Reel; Dominant Wavelength: 520nm; Length: 1.6mm; Width: 0.8mm; Height: 0.7mm; REACH SVHC: Unknown; Lead Free: Lead Free; ComponentLink1URL: https://datasheet.ciiva.com/29562/150060gs75000-29562868.pdf?src-supplier=Digi-Key; ComponentLink1Description: https://datasheet.ciiva.com/29562/150060gs75000-29562868.pdf?src-supplier=Digi-Key; ComponentLink2URL: https://datasheet.ciiva.com/29279/759427-da-01-en-chipled-0603-w-kl-gruen-150060gs75000-29279201.pdf?src-supplier=Conrad; ComponentLink2Description: https://datasheet.ciiva.com/29279/759427-da-01-en-chipled-0603-w-kl-gruen-150060gs75000-29279201.pdf?src-supplier=Conrad; ComponentLink3URL: https://datasheet.ciiva.com/29562/150060gs75000-29562869.pdf?src-supplier=Digi-Key; ComponentLink3Description: https://datasheet.ciiva.com/29562/150060gs75000-29562869.pdf?src-supplier=Digi-Key; ComponentLink4URL: https://datasheet.ciiva.com/29562/150060gs75000-29562870.pdf?src-supplier=Digi-Key; ComponentLink4Description: https://datasheet.ciiva.com/29562/150060gs75000-29562870.pdf?src-supplier=Digi-Key
R77-R83 R85-R92 R99 R101-R111 = RC0603FR-13180RL: YAGEO 0603 180 ohm; Manufacturer_Name: KEMET; Manufacturer_Part_Number: RC0603JR-070RL; Geometry.Height: 0.55mm; Mouser Part Number: 603-RC0603JR-070RL; Mouser Price/Stock: https://www.mouser.co.uk/ProductDetail/YAGEO/RC0603JR-070RL?qs=2cAdsCoAWRGWyPcuXgGiXQ%3D%3D; Datasheet Link: https://datasheet.datasheetarchive.com/originals/distributors/Datasheets_SAMA/902f9e387b938f871d31120f5fc1d65e.pdf
R84 = RC0603FR-0747KL: YAGEO 0603 47; Manufacturer_Name: KEMET; Manufacturer_Part_Number: RC0603JR-070RL; Geometry.Height: 0.55mm; Mouser Part Number: 603-RC0603JR-070RL; Mouser Price/Stock: https://www.mouser.co.uk/ProductDetail/YAGEO/RC0603JR-070RL?qs=2cAdsCoAWRGWyPcuXgGiXQ%3D%3D; Datasheet Link: https://datasheet.datasheetarchive.com/originals/distributors/Datasheets_SAMA/902f9e387b938f871d31120f5fc1d65e.pdf
R93-R98 R112-R128 = RC0603JR-070RL: as R1 on sheet SD_Card; Mouser Part Number: 603-RC0603JR-070RL; Mouser Price/Stock: https://www.mouser.co.uk/ProductDetail/YAGEO/RC0603JR-070RL?qs=2cAdsCoAWRGWyPcuXgGiXQ%3D%3D; Manufacturer_Part_Number: RC0603JR-070RL; Datasheet Link: https://datasheet.datasheetarchive.com/originals/distributors/Datasheets_SAMA/902f9e387b938f871d31120f5fc1d65e.pdf
R100 = RC0603FR-10100RL: YAGEO 0603 100 ohm; Manufacturer_Name: KEMET; Manufacturer_Part_Number: RC0603JR-070RL; Geometry.Height: 0.55mm; Mouser Part Number: 603-RC0603JR-070RL; Mouser Price/Stock: https://www.mouser.co.uk/ProductDetail/YAGEO/RC0603JR-070RL?qs=2cAdsCoAWRGWyPcuXgGiXQ%3D%3D; Datasheet Link: https://datasheet.datasheetarchive.com/originals/distributors/Datasheets_SAMA/902f9e387b938f871d31120f5fc1d65e.pdf
TP8-TP15 = TP: as TP1 on sheet SD_Card; Supplier 1: Digi-Key; RoHS: Yes; Category: Headers and Wire Housings; Stock 1: 227; Pricing 1: 1=2.85000, 10=2.73600, 100=2.28000, 500=1.93800, 1000=1.65300, 5000=1.48200 (USD); Mount: Through Hole; Contact Plating: Gold; Contact Material: Bronze; Housing Material: Polyester; Housing Color: Black; Color: Black; Min Operating Temperature: -55°C; Max Operating Temperature: 125°C; Number of Rows: 2; Termination: Solder; Packaging: Rail/Tube; Orientation: Straight; Number of Positions: 16; Length: 27.94mm; Depth: 9.27mm; Contact Mating Length: 0.25inch; REACH SVHC: No SVHC; ComponentLink1URL: https://datasheet.ciiva.com/739/tst-mkt-739845.pdf?src-supplier=Digi-Key; ComponentLink1Description: https://datasheet.ciiva.com/739/tst-mkt-739845.pdf?src-supplier=Digi-Key; ComponentLink2URL: https://datasheet.ciiva.com/10018/htst-10018510.pdf?src-supplier=Avnet; ComponentLink2Description: https://datasheet.ciiva.com/10018/htst-10018510.pdf?src-supplier=Avnet
U1 = SN74ABT240ADBR: Octal Buffers/Drivers With 3-State Outputs; Manufacturer_Name: Texas Instruments; Geometry.Height: 2mm; Mouser Part Number: 595-SN74ABT240ADBR; Mouser Price/Stock: https://www.mouser.co.uk/ProductDetail/Texas-Instruments/SN74ABT240ADBR?qs=JHHQeKcAU3Dt82k%252BVyiYdw%3D%3D; Manufacturer_Part_Number: SN74ABT240ADBR; Datasheet Link: http://www.ti.com/lit/gpn/sn74abt240a
U2-U4 = SN74AC04PWR: Hex Inverters; Manufacturer_Name: Texas Instruments; Geometry.Height: 1.2mm; Mouser Part Number: 595-SN74AC04PWR; Mouser Price/Stock: https://www.mouser.co.uk/ProductDetail/Texas-Instruments/SN74AC04PWR?qs=RZS%252BpEsUn7pRvPNqsga4SA%3D%3D; Manufacturer_Part_Number: SN74AC04PWR; Datasheet Link: http://www.ti.com/lit/gpn/sn74ac04

## Nets that join several sheets
+3.3: SD_Card (10 pins), PowerSupply (C8.1 C9.1), SD_Card_Led_Monitor (R84.1)
+5: SD_Card (15 pins), PowerSupply (7 pins), SD_Card_Led_Monitor (32 pins)
GND: SD_Card (16 pins), PowerSupply (9 pins), SD_Card_Led_Monitor (8 pins)
CPU_CS: SD_Card (R18.2 R47.2), SD_Card_Led_Monitor (R121.1)
CPU_D0: SD_Card (R4.1 R23.1), SD_Card_Led_Monitor (U1.2)
CPU_D1: SD_Card (R6.1 R25.1), SD_Card_Led_Monitor (U1.4)
CPU_D2: SD_Card (R7.1 R27.1), SD_Card_Led_Monitor (U1.6)
CPU_D3: SD_Card (R12.1 R29.1), SD_Card_Led_Monitor (U1.8)
CPU_D4: SD_Card (R17.1 R31.1), SD_Card_Led_Monitor (U1.11)
CPU_D5: SD_Card (R19.1 R33.1), SD_Card_Led_Monitor (U1.13)
CPU_D6: SD_Card (R21.1 R35.1), SD_Card_Led_Monitor (U1.15)
CPU_D7: SD_Card (R22.1 R37.1), SD_Card_Led_Monitor (U1.17)
CPU_nInt: SD_Card (R8.2 R49.2), SD_Card_Led_Monitor (R112.1)
CPU_Reset: SD_Card (H3.1 R20.2 R26.2), SD_Card_Led_Monitor (R115.1)
CPU_RnW: SD_Card (R13.2 R48.2), SD_Card_Led_Monitor (R96.1)
pCLK_SCLK: SD_Card (R44.1 R69.1), SD_Card_Led_Monitor (R95.1)
pCMD_MOSI: SD_Card (R40.1 R65.1), SD_Card_Led_Monitor (R93.1)
pDAT0_MISO: SD_Card (R42.1 R67.1), SD_Card_Led_Monitor (R94.1)
pDAT3_CS: SD_Card (R46.1 R71.1), SD_Card_Led_Monitor (R118.1)
PI_I2C_SDA: SD_Card (H3.5 J2.2 R30.2), SD_Card_Led_Monitor (R117.1)
PI_I2C_SDC: SD_Card (H3.3 J1.2 R28.2), SD_Card_Led_Monitor (R114.1)
PI_SPI_CS: SD_Card (H3.6 J6.2 R38.2), SD_Card_Led_Monitor (R124.1)
PI_SPI_MISO: SD_Card (H3.9 J4.2 R34.2), SD_Card_Led_Monitor (R125.1)
PI_SPI_MOSI: SD_Card (H3.7 J3.2 R32.2), SD_Card_Led_Monitor (R122.1)
PI_SPI_SCLK: SD_Card (H3.4 J5.2 R36.2), SD_Card_Led_Monitor (R127.1)
pSD_DAT1: SD_Card (R41.2 R54.1), SD_Card_Led_Monitor (R113.1)
pSD_DAT2: SD_Card (R43.2 R55.1), SD_Card_Led_Monitor (R116.1)
pSD_LED: SD_Card (R39.2), SD_Card_Led_Monitor (R98.1)
SD_Card_Detect: SD_Card (J7.9 R45.2 R62.1), SD_Card_Led_Monitor (R119.1)